# EAGLE design micro_board (EAGLE 7.7.0)
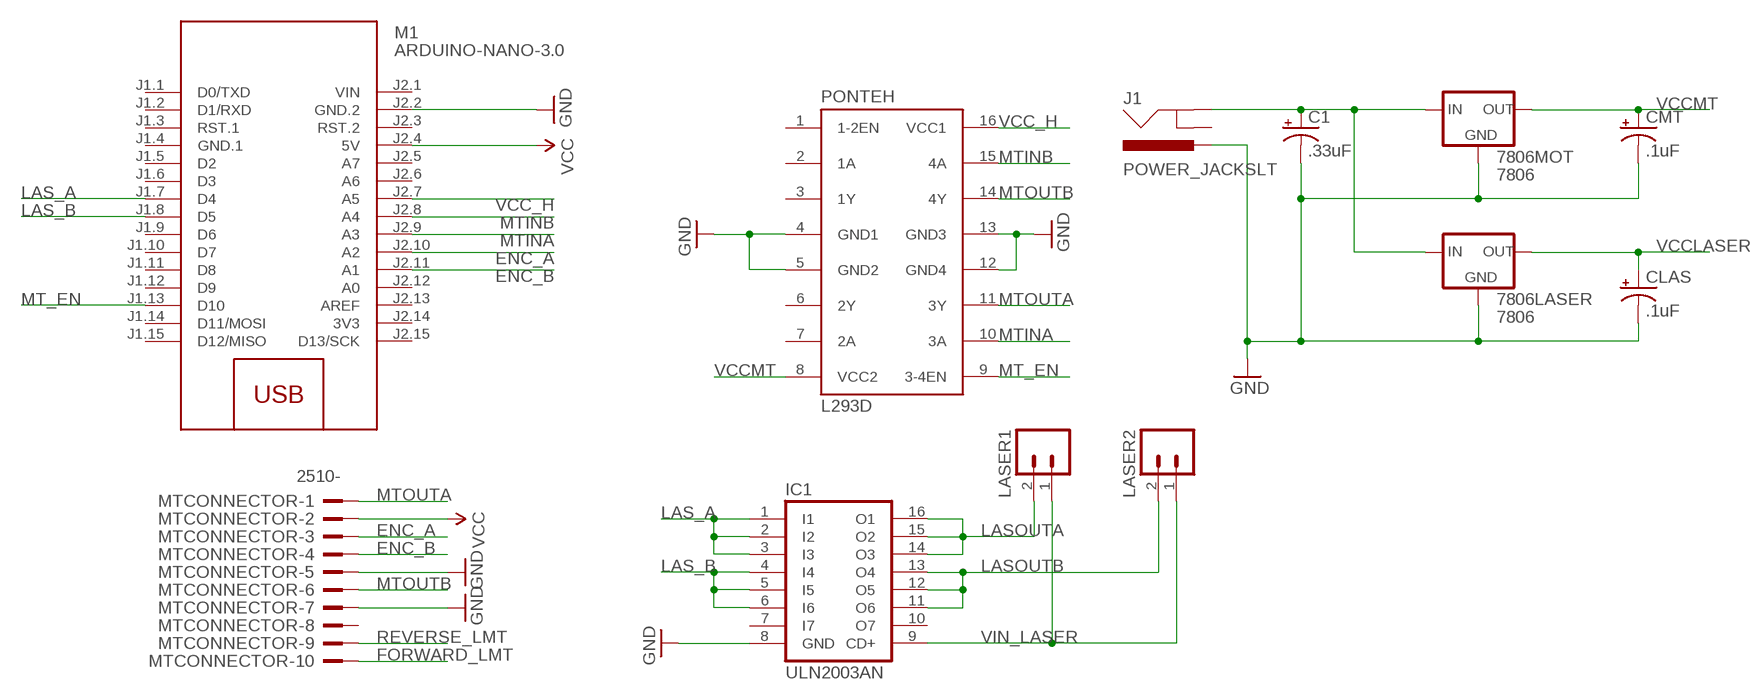
[diagram p0: schematic, sheet 1]

## Parts
7806LASER  7806  V_REG_78XXSINK  [TO220-IGO]
7806MOT  7806  V_REG_78XXSINK  [TO220-IGO]
C1  .33uF  CAP_POLPTH1  [CPOL-RADIAL-100UF-25V]
CLAS  .1uF  CAP_POLPTH1  [CPOL-RADIAL-100UF-25V]
CMT  .1uF  CAP_POLPTH1  [CPOL-RADIAL-100UF-25V]
IC1  ULN2003AN  [DIL16]
J1  POWER_JACKSLT  [POWER_JACK_SLOT]
LASER1  M02POLAR  [MOLEX-1X2]
LASER2  M02POLAR  [MOLEX-1X2]
M1  ARDUINO-NANO-3.0  [ARDUINO-NANO-3.0]
MTCONNECTOR  2510-  [PAK100/2500-10]
PONTEH  L293D  [DIL16]

## Nets
ENC_A: M1.J2.10(A2) MTCONNECTOR.3
ENC_B: M1.J2.11(A1) MTCONNECTOR.4
FORWARD_LMT: MTCONNECTOR.10
GND: 7806LASER.GND 7806MOT.GND C1.2(-) CLAS.2(-) CMT.2(-) IC1.8(GND) J1.PWR M1.J2.2(GND.2) MTCONNECTOR.5 MTCONNECTOR.7 PONTEH.4(GND1) PONTEH.5(GND2) PONTEH.12(GND4) PONTEH.13(GND3)
LAS_A: IC1.1(I1) IC1.2(I2) IC1.3(I3) M1.J1.7(D4)
LAS_B: IC1.4(I4) IC1.5(I5) IC1.6(I6) M1.J1.8(D5)
LASOUTA: IC1.14(O3) IC1.15(O2) IC1.16(O1) LASER1.2
LASOUTB: IC1.11(O6) IC1.12(O5) IC1.13(O4) LASER2.2
MT_EN: M1.J1.13(D10) PONTEH.9(3-4EN)
MTINA: M1.J2.9(A3) PONTEH.10(3A)
MTINB: M1.J2.8(A4) PONTEH.15(4A)
MTOUTA: MTCONNECTOR.1 PONTEH.11(3Y)
MTOUTB: MTCONNECTOR.6 PONTEH.14(4Y)
REVERSE_LMT: MTCONNECTOR.9
SRCIN: 7806LASER.IN 7806MOT.IN C1.1(+) J1.GND@2(GND)
VCC: M1.J2.4(5V) MTCONNECTOR.2
VCC_H: M1.J2.7(A5) PONTEH.16(VCC1)
VCCLASER: 7806LASER.OUT CLAS.1(+)
VCCMT: 7806MOT.OUT CMT.1(+) PONTEH.8(VCC2)
VIN_LASER: IC1.9(CD+) LASER1.1 LASER2.1
Unconnected: IC1.7(I7) IC1.10(O7) J1.GND@1(GNDBREAK) M1.J1.1(D0/TXD) M1.J1.2(D1/RXD) M1.J1.3(RST.1) M1.J1.5(D2) M1.J1.6(D3) M1.J1.9(D6) M1.J1.10(D7) M1.J1.11(D8) M1.J1.12(D9) M1.J1.14(D11/MOSI) M1.J1.15(D12/MISO) M1.J2.3(RST.2) M1.J2.5(A7) M1.J2.6(A6) M1.J2.12(A0) M1.J2.13(AREF) M1.J2.15(D13/SCK) MTCONNECTOR.8 PONTEH.1(1-2EN) PONTEH.2(1A) PONTEH.3(1Y) PONTEH.6(2Y) PONTEH.7(2A)

## Power pins joined to a net without a drawn wire
3V3: M1.J2.14(3V3)
GND.1: M1.J1.4(GND.1)
VIN: M1.J2.1(VIN)

## Library data of the parts
7806LASER 7806MOT = SparkFun-PowerIC:V_REG_78XX: Voltage Regulator Standard 78xx regulator. IGO (Input Ground Output). Spark Fun Electronics SKU : COM-00107
C1 CLAS CMT = SparkFun-Capacitors:CAP_POL: Capacitor Polarized These are standard SMD and PTH capacitors. Normally 10uF, 47uF, and 100uF in electrolytic and tantalum varieties. Always verify the external diameter of the through hole cap, it varies with capacity, voltage, and manufacturer. The EIA devices should be standard.
IC1 = uln-udn:ULN2003A: DRIVER ARRAY
J1 = SparkFun-Connectors:POWER_JACK: Power Jack This is the standard 5.5mm barrel jack for power. The PTH is the most common, proven, reliable, footprint. The Slot footprint only works if the mill layer is transmitted to the PCB fab house so be warned. Mating wall wart : TOL-00298 (and others); PROD_ID: PRT-00119
LASER1 LASER2 = SparkFun-Connectors:M02: Standard 2-pin 0.1" header. Use with - straight break away headers ( PRT-00116) - right angle break away headers (PRT-00553) - swiss pins (PRT-00743) - machine pins (PRT-00117) - female headers (PRT-00115) Molex polarized connector foot print use with: PRT-08233 with associated crimp pins and housings. 2.54_SCREWTERM for use with PRT-10571. 3.5mm Screw Terminal footprints for PRT-08084 5mm Screw Terminal footprints for use with PRT-08432
M1 = diy-modules:ARDUINO-NANO-3.0: Arduino Nano 3.0
MTCONNECTOR = con-3m:2510-: 3M (TM) Pak 100 4-Wall Header Source: 3M; MF: 3M; MPN: 2510-6002UB; OC_FARNELL: 9838244; OC_NEWARK: 46F4725
PONTEH = st-microelectronics:L293D: PUSH-PULL 4 CHANNEL DRIVER; MPN: L293D; OC_FARNELL: 9589619; OC_NEWARK: 56P8249

## Board
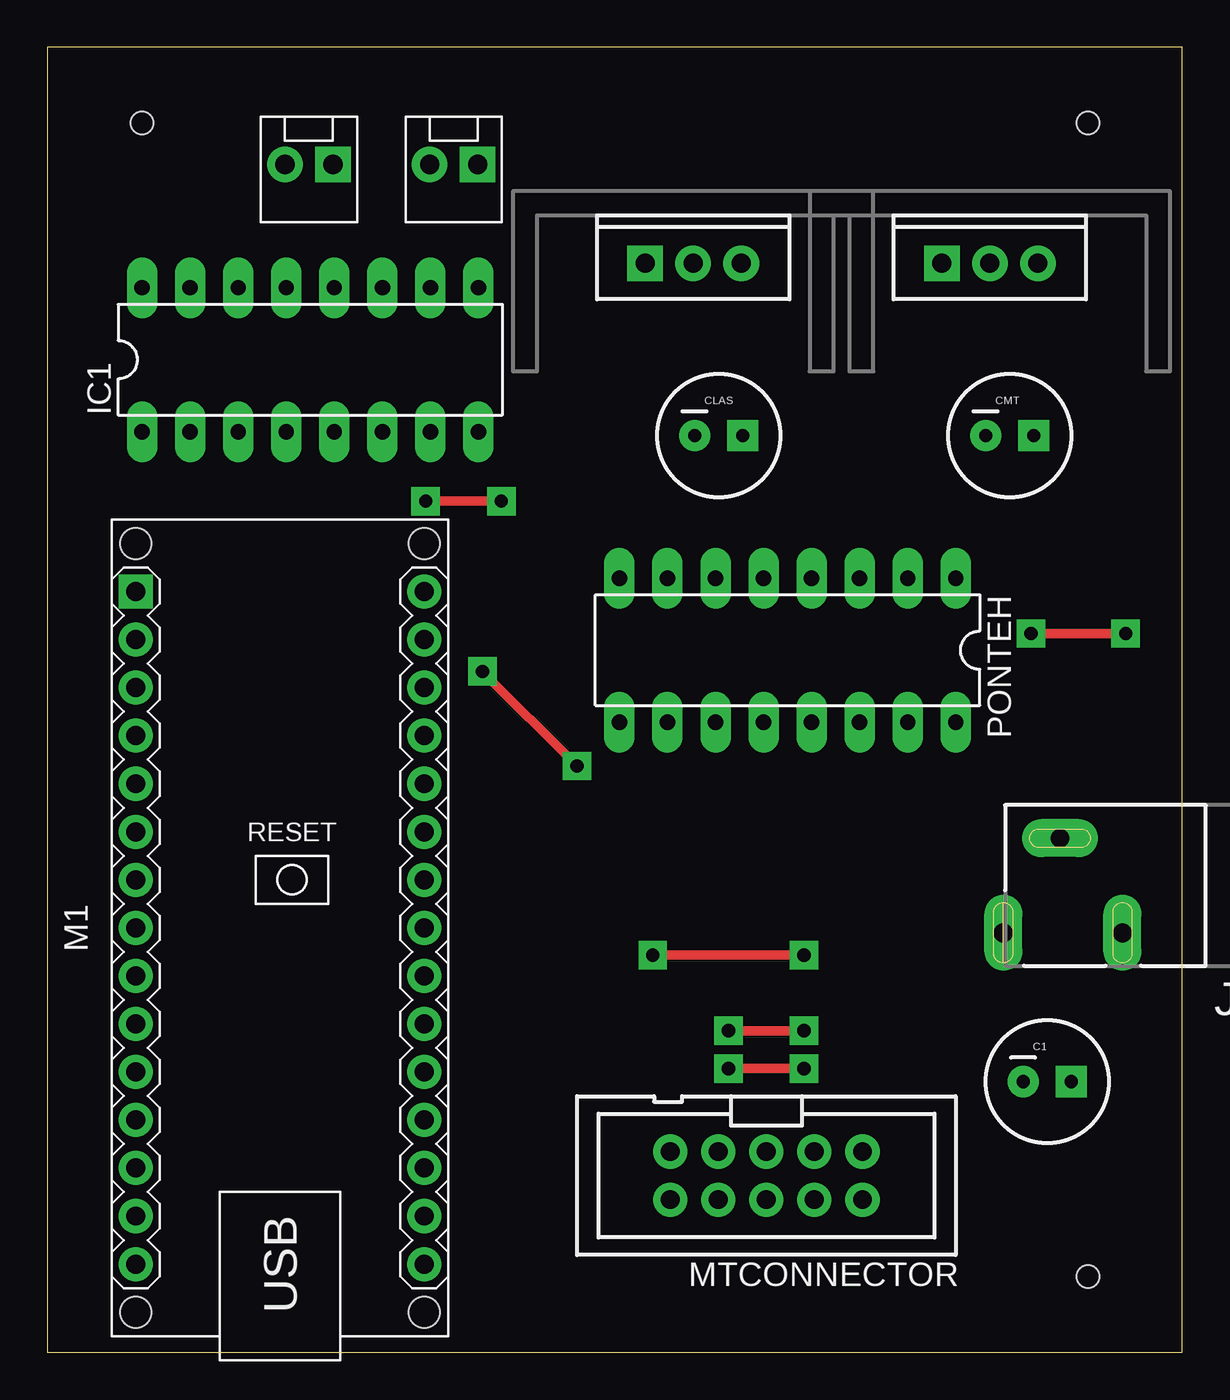
[diagram p1: board, top side]
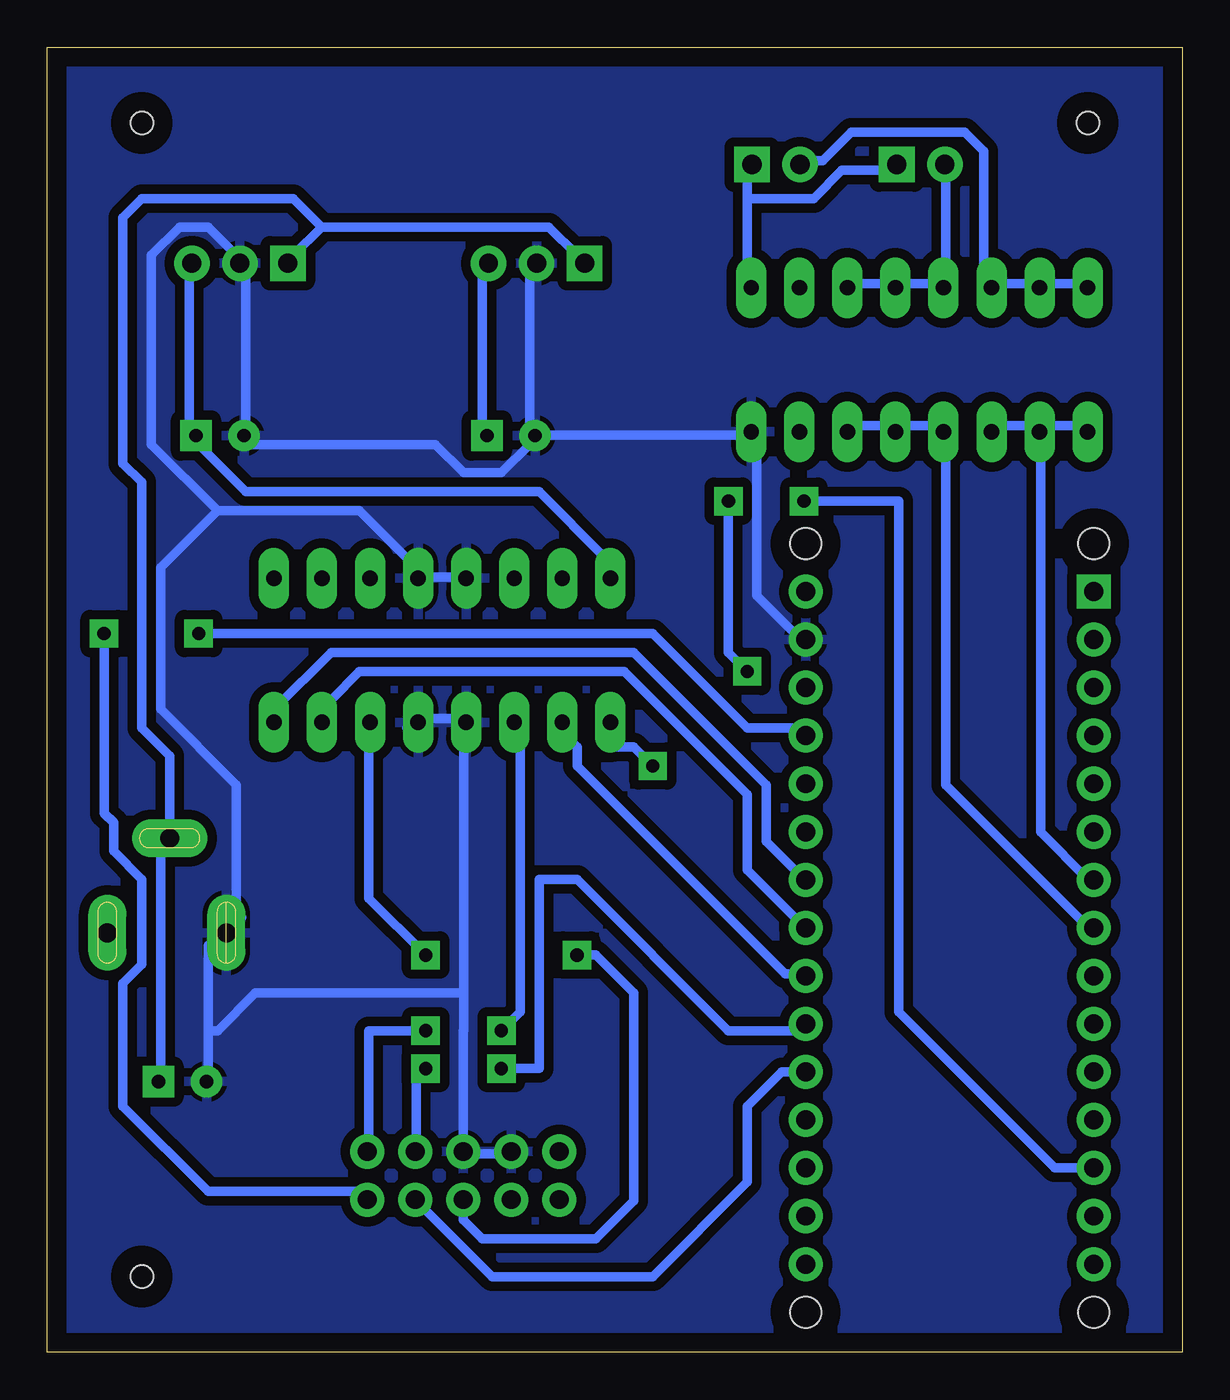
[diagram p2: board, bottom side, seen from below]

Size 60 x 69 mm. Coordinates in mm from the lower left corner, seen from the top.
Outline: 0,0 60,0 60,69 0,69 0,0
Copper layers (1*16): Top 0.035mm / dielectric 1.5mm / Bottom 0.035mm
Design rules "default *": minimum track width 0.5mm, minimum drill 24mil, track to track 0.5mm, track to pad 0.5mm, pad to pad 8mil, via to via 8mil, smd to smd 8mil, copper to edge 40mil, drill to drill 8mil, minimum pad ring 0.4mm, minimum via ring 0.4mm, stop-mask expansion 4mil, vias tented up to drill 0mil, thermal gap 10mil
Holes 1.2 mm at 5,65 55,65 55,4

### Footprints (pad centres in the part's own frame; a part is rotated, then mirrored left to right if it is on the bottom)
TO220-IGO = drill 1 pad 1.88: GND 0,0; OUT 2.54,0 | drill 1 pad 1.88 square: IN -2.54,0
CPOL-RADIAL-100UF-25V = drill 0.7 pad 1.651 square: 1 1.27,0 | drill 0.7 pad 1.651: 2 -1.27,0
DIL16 = drill 0.813 long: 1 -8.89,-3.81; 2 -6.35,-3.81; 3 -3.81,-3.81; 4 -1.27,-3.81; 5 1.27,-3.81; 6 3.81,-3.81; 7 6.35,-3.81; 8 8.89,-3.81; 9 8.89,3.81; 10 6.35,3.81; 11 3.81,3.81; 12 1.27,3.81; 13 -1.27,3.81; 14 -3.81,3.81; 15 -6.35,3.81; 16 -8.89,3.81
POWER_JACK_SLOT = drill 1 pad 2 long: GND@1 2.58,7.5; GND@2 7.58,10.8; PWR 2.58,13.8
MOLEX-1X2 = drill 1.016 pad 1.88 square: 1 0,0 | drill 1.016 pad 1.88: 2 2.54,0
ARDUINO-NANO-3.0 = drill 1 square: J1.1 17.78,7.62 | drill 1: J1.2 15.24,7.62; J1.3 12.7,7.62; J1.4 10.16,7.62; J1.5 7.62,7.62; J1.6 5.08,7.62; J1.7 2.54,7.62; J1.8 0,7.62; J1.9 -2.54,7.62; J1.10 -5.08,7.62; J1.11 -7.62,7.62; J1.12 -10.16,7.62; J1.13 -12.7,7.62; J1.14 -15.24,7.62; J1.15 -17.78,7.62; J2.1 17.78,-7.62; J2.2 15.24,-7.62; J2.3 12.7,-7.62; J2.4 10.16,-7.62; J2.5 7.62,-7.62; J2.6 5.08,-7.62; J2.7 2.54,-7.62; J2.8 0,-7.62; J2.9 -2.54,-7.62; J2.10 -5.08,-7.62; J2.11 -7.62,-7.62; J2.12 -10.16,-7.62; J2.13 -12.7,-7.62; J2.14 -15.24,-7.62; J2.15 -17.78,-7.62 | hole 1.651: -20.32,7.62; -20.32,-7.62; 20.32,-7.62; 20.32,7.62
PAK100/2500-10 = drill 1 pad 1.422: 1 -5.08,-1.27; 2 -5.08,1.27; 3 -2.54,-1.27; 4 -2.54,1.27; 5 0,-1.27; 6 0,1.27; 7 2.54,-1.27; 8 2.54,1.27; 9 5.08,-1.27; 10 5.08,1.27

### Placement (x,y rotation side)
7806LASER  34.14,57.58 0 top
7806MOT  49.82,57.58 0 top
C1  52.85,14.31 0 top
CLAS  35.49,48.47 0 top
CMT  50.87,48.47 0 top
IC1  13.9,52.48 0 top
J1  64.33,19.6 90 top
LASER1  22.75,62.8 180 top
LASER2  15.1,62.8 180 top
M1  12.3,22.44 90 top
MTCONNECTOR  38.01,9.34 180 top
PONTEH  39.13,37.12 180 top

### Tracks (layer width: path | path; a pad name or v marks a point on that pad's centre or on a via)
ENC_A  (via drill 0.7)
  Top 0.5: v40,15 v36,15
  Bottom 0.5: MTCONNECTOR.3 40.5,11 40.5,14.5 v40,15 | 20,17 M1.J2.10 20.28,17 24,17 32,25 34,25 34,15 v36,15
ENC_B
  Bottom 0.5: 40.5,8 MTCONNECTOR.4 36.48,4 28,4 23,9 23,13 21.18,14.82 M1.J2.11 20,15
GND
  Bottom 0.5: PONTEH.5 38,41 40,41 PONTEH.4 40.5,41 40.5,41.5 43.5,44.5 51,44.5 | 51,44.5 54.5,48 54.5,58 53,59.5 51.5,59.5 50,58 7806MOT.GND 49.5,57.5 49.5,48.5 CMT.2 49.5,48 39.5,48 38,46.5 36,46.5 34.5,48 CLAS.2 | CLAS.2 34,48.5 23,48.5 IC1.8 22.5,48.5 22.5,40 20.5,38 20,38 M1.J2.2 | 7806LASER.GND 34.5,57.5 34.5,48.5 CLAS.2 | MTCONNECTOR.7 35.5,10.5 38,10.5 MTCONNECTOR.5 38.01,16.99 38,17 38,19 | 38,33.5 PONTEH.12 | 40,33.5 PONTEH.13 40.5,33 40.5,32.5 | 51.5,17 51.5,21.5 51,22 J1.PWR | 51.5,17 51.5,14.5 C1.2 | 50.5,22.5 J1.PWR | 40,33.5 40.5,33.5 41,33 | 51,44.5 54,41.5 54,34 50,30 50,23 49.71,23 J1.PWR | 38,33.5 40,33.5 | 38,33.5 38,19 | 51.5,17 51,17 49,19 38,19
  pour Bottom: 0,69 0,0 60,0 60,3 60,69
LAS_A
  Bottom 0.5: IC1.1 5.5,49 7.5,49 IC1.2 | IC1.3 10,49 8,49 IC1.2 | M1.J1.7 5,25 7.5,27.5 7.5,48.5 IC1.2
LAS_B
  Bottom 0.5: IC1.6 17.5,49 15.5,49 IC1.5 15,49 13,49 IC1.4 12.5,48.5 12.5,30 5,22.5 M1.J1.8
LASOUTA
  Bottom 0.5: IC1.16 5.5,56.5 7.5,56.5 IC1.15 8,56.5 10,56.5 IC1.14 10.5,56.5 10.5,63.5 11.5,64.5 17.5,64.5 19,63 20,63 LASER1.2
LASOUTB
  Bottom 0.5: IC1.11 17.5,56.5 15.5,56.5 IC1.12 15,56.5 13,56.5 IC1.13 12.5,56.5 12.5,62.5 LASER2.2
MT_EN  (via drill 0.7)
  Top 0.5: v20,45 v24,45 | v28,31 v23,36
  Bottom 0.5: M1.J1.13 6.74,9.74 15,18 15,45 v20,45 | PONTEH.9 30.24,32.24 30,32 29,32 v28,31 | v23,36 24,37 v24,45
MTINA
  Bottom 0.5: PONTEH.10 32.5,33 32.5,32.5 32,32 32,31 21,20 20,20 M1.J2.9
MTINB
  Bottom 0.5: PONTEH.15 45,33.5 45,34.5 43.5,36 29.5,36 23,29.5 23,25.5 20,22.5 M1.J2.8
MTOUTA  (via drill 0.7)
  Top 0.5: v40,17 v36,17
  Bottom 0.5: 35.5,33 PONTEH.11 35,32.99 35,18 v36,17 | MTCONNECTOR.1 43,11 43,17 v40,17
MTOUTB  (via drill 0.7)
  Top 0.5: v32,21 v40,21
  Bottom 0.5: MTCONNECTOR.6 38.01,7.01 37,6 31,6 29,8 29,19 31,21 v32,21 | v40,21 43,24 43,33.25 PONTEH.14
N$2
  pour Bottom: 0,69 0,0 60,0 60,69
SRCIN
  Bottom 0.5: C1.1 54,14.5 54,27 J1.GND@2 53.53,31.53 55,33 55,46 56,47 56,60 55,61 47,61 45.5,59.5 | 45.5,59.5 33.5,59.5 32,58 7806LASER.IN | 45.5,59.5 47,58 7806MOT.IN
VCC  (via drill 0.7)
  Top 0.5: v52,38 v57,38
  Bottom 0.5: MTCONNECTOR.2 43.5,8.5 51.5,8.5 56,13 56,19.5 55,20.5 55,25 56.5,26.5 56.5,28 57,28.5 v57,38 | 20,32.5 M1.J2.4 20.32,33 23,33 28,38 v52,38
VCC_H
  Bottom 0.5: PONTEH.16 48,33.5 48,34 45,37 29,37 22,30 22,27 20,25 M1.J2.7
VCCLASER
  Bottom 0.5: CLAS.1 37,48.5 37,57.5 7806LASER.OUT
VCCMT
  Bottom 0.5: PONTEH.8 30.5,41 30.5,42 34,45.5 49.5,45.5 52,48 CMT.1 52.5,48.5 52.5,57.5 7806MOT.OUT
VIN_LASER
  Bottom 0.5: 23,61 23,62.5 LASER1.1 | 23,61 23,56.5 IC1.9 | 23,61 19.5,61 18,62.5 15.5,62.5 LASER2.1